# EAGLE design Recorder (EAGLE 9.6.2)

## Sheet 1 of 3: MCU
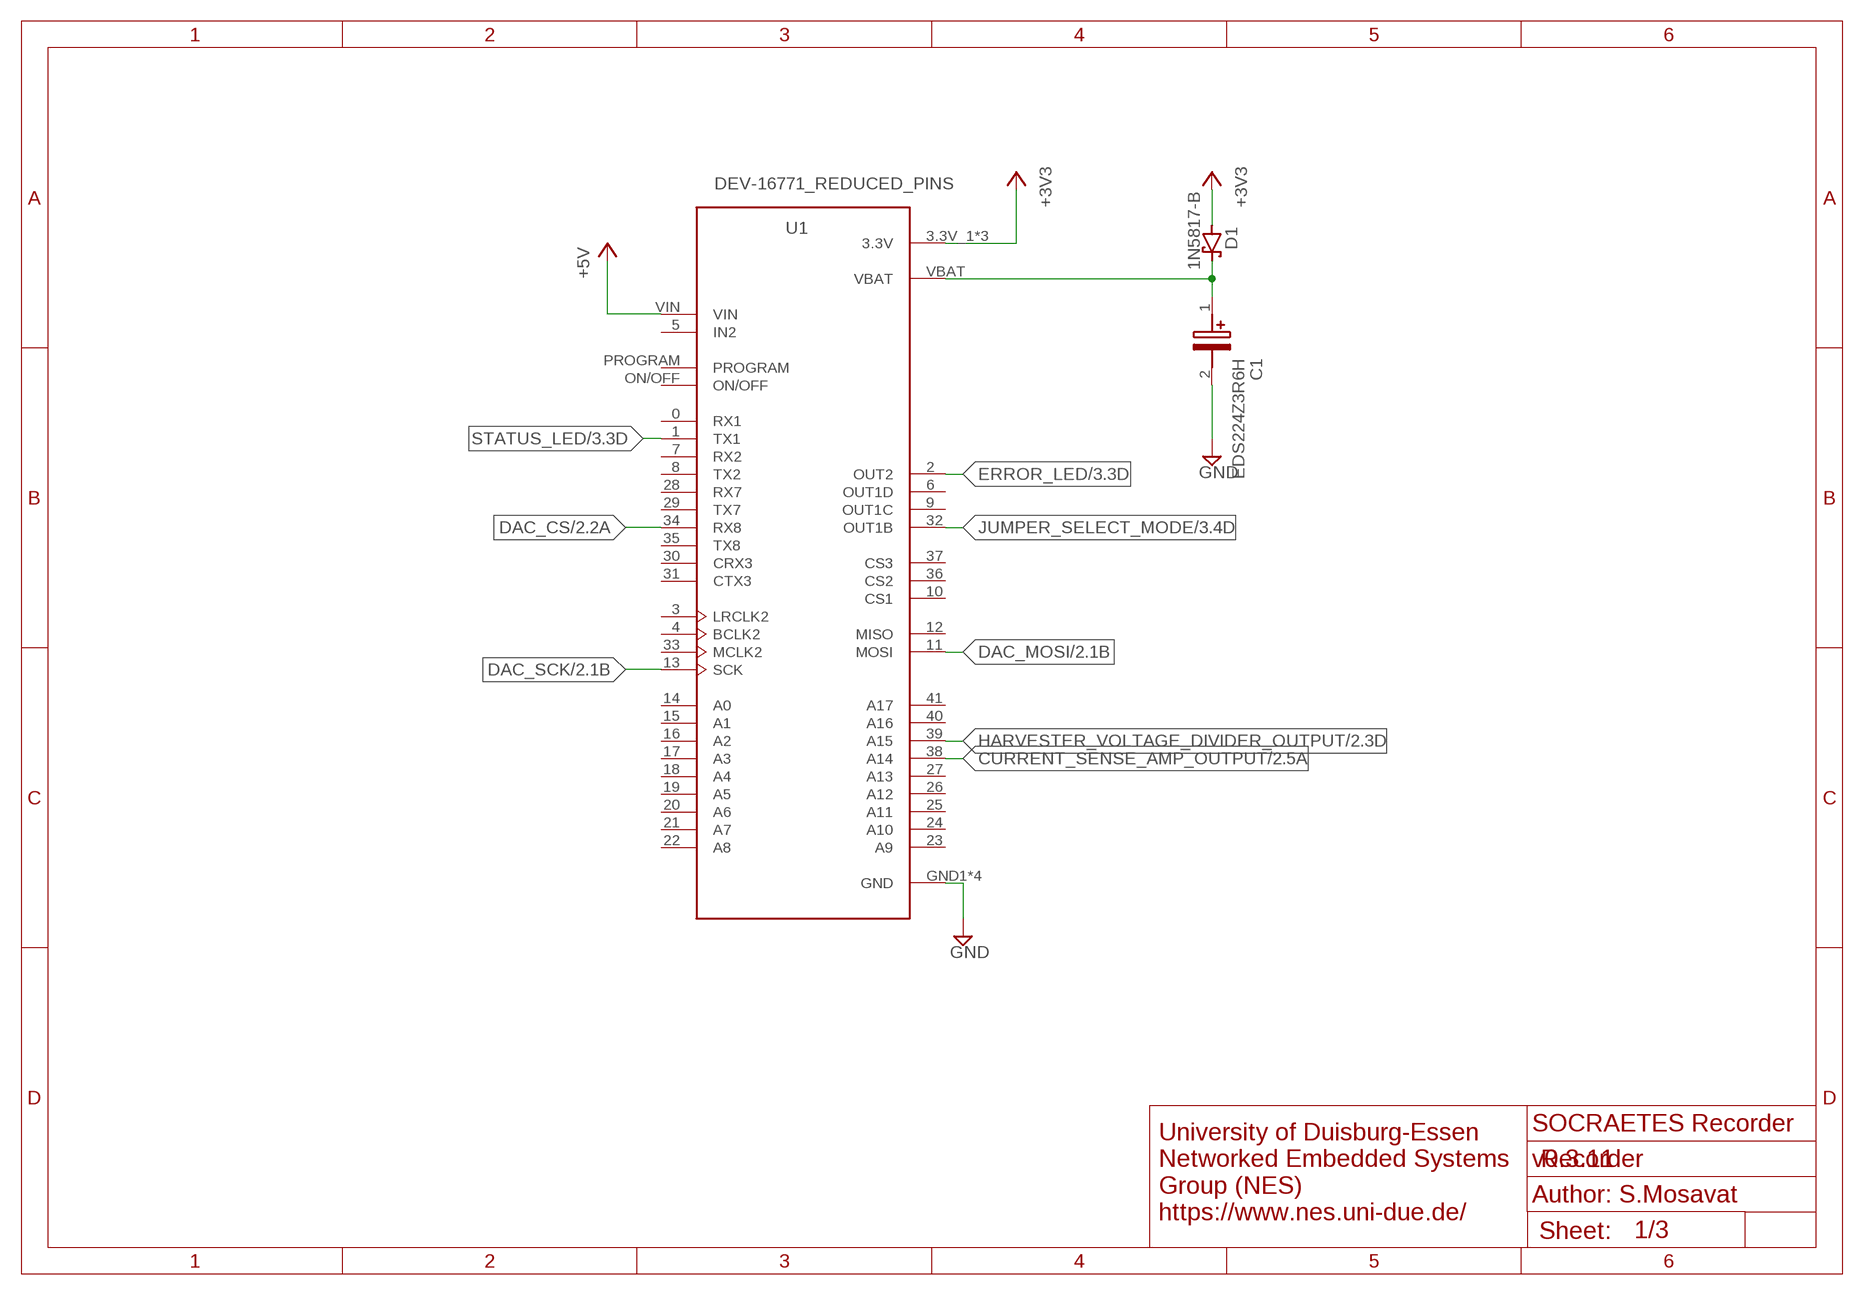
[diagram p0: schematic, sheet 1]

### Parts
C1  EDS224Z3R6H  [EDS224Z3R6H]
D1  1N5817-B  [DO41-7.6]
U1  DEV-16771_REDUCED_PINS  [MODULE_DEV-16771_REDUCED_PINS]

### Nets
+3V3: D1.A U1.3.3V_1(3.3V) U1.3.3V_2(3.3V) U1.3.3V_3(3.3V) ; also sheet 3
+5V: U1.VIN ; also sheet 2,3
CURRENT_SENSE_AMP_OUTPUT: U1.38(A14) ; also sheet 2
DAC_CS: U1.34(RX8) ; also sheet 2
DAC_MOSI: U1.11(MOSI) ; also sheet 2
DAC_SCK: U1.13(SCK) ; also sheet 2
ERROR_LED: U1.2(OUT2) ; also sheet 3
GND: C1.2(-) U1.GND1(GND) U1.GND2(GND) U1.GND3(GND) U1.GND4(GND) ; also sheet 2,3
HARVESTER_VOLTAGE_DIVIDER_OUTPUT: U1.39(A15) ; also sheet 2
JUMPER_SELECT_MODE: U1.32(OUT1B) ; also sheet 3
N$2: C1.1(+) D1.C U1.VBAT
STATUS_LED: U1.1(TX1) ; also sheet 3
Unconnected: U1.0(RX1) U1.3(LRCLK2) U1.4(BCLK2) U1.5(IN2) U1.6(OUT1D) U1.7(RX2) U1.8(TX2) U1.9(OUT1C) U1.10(CS1) U1.12(MISO) U1.14(A0) U1.15(A1) U1.16(A2) U1.17(A3) U1.18(A4) U1.19(A5) U1.20(A6) U1.21(A7) U1.22(A8) U1.23(A9) U1.24(A10) U1.25(A11) U1.26(A12) U1.27(A13) U1.28(RX7) U1.29(TX7) U1.30(CRX3) U1.31(CTX3) U1.33(MCLK2) U1.35(TX8) U1.36(CS2) U1.37(CS3) U1.40(A16) U1.41(A17) U1.ON/OFF U1.PROGRAM

### Notes on the sheet
- SOCRAETES Recorder
- v0.3.11
- Author: S.Mosavat
- University of Duisburg-Essen
  Networked Embedded Systems
  Group (NES)
  https://www.nes.uni-due.de/

## Sheet 2 of 3: Analog front-end
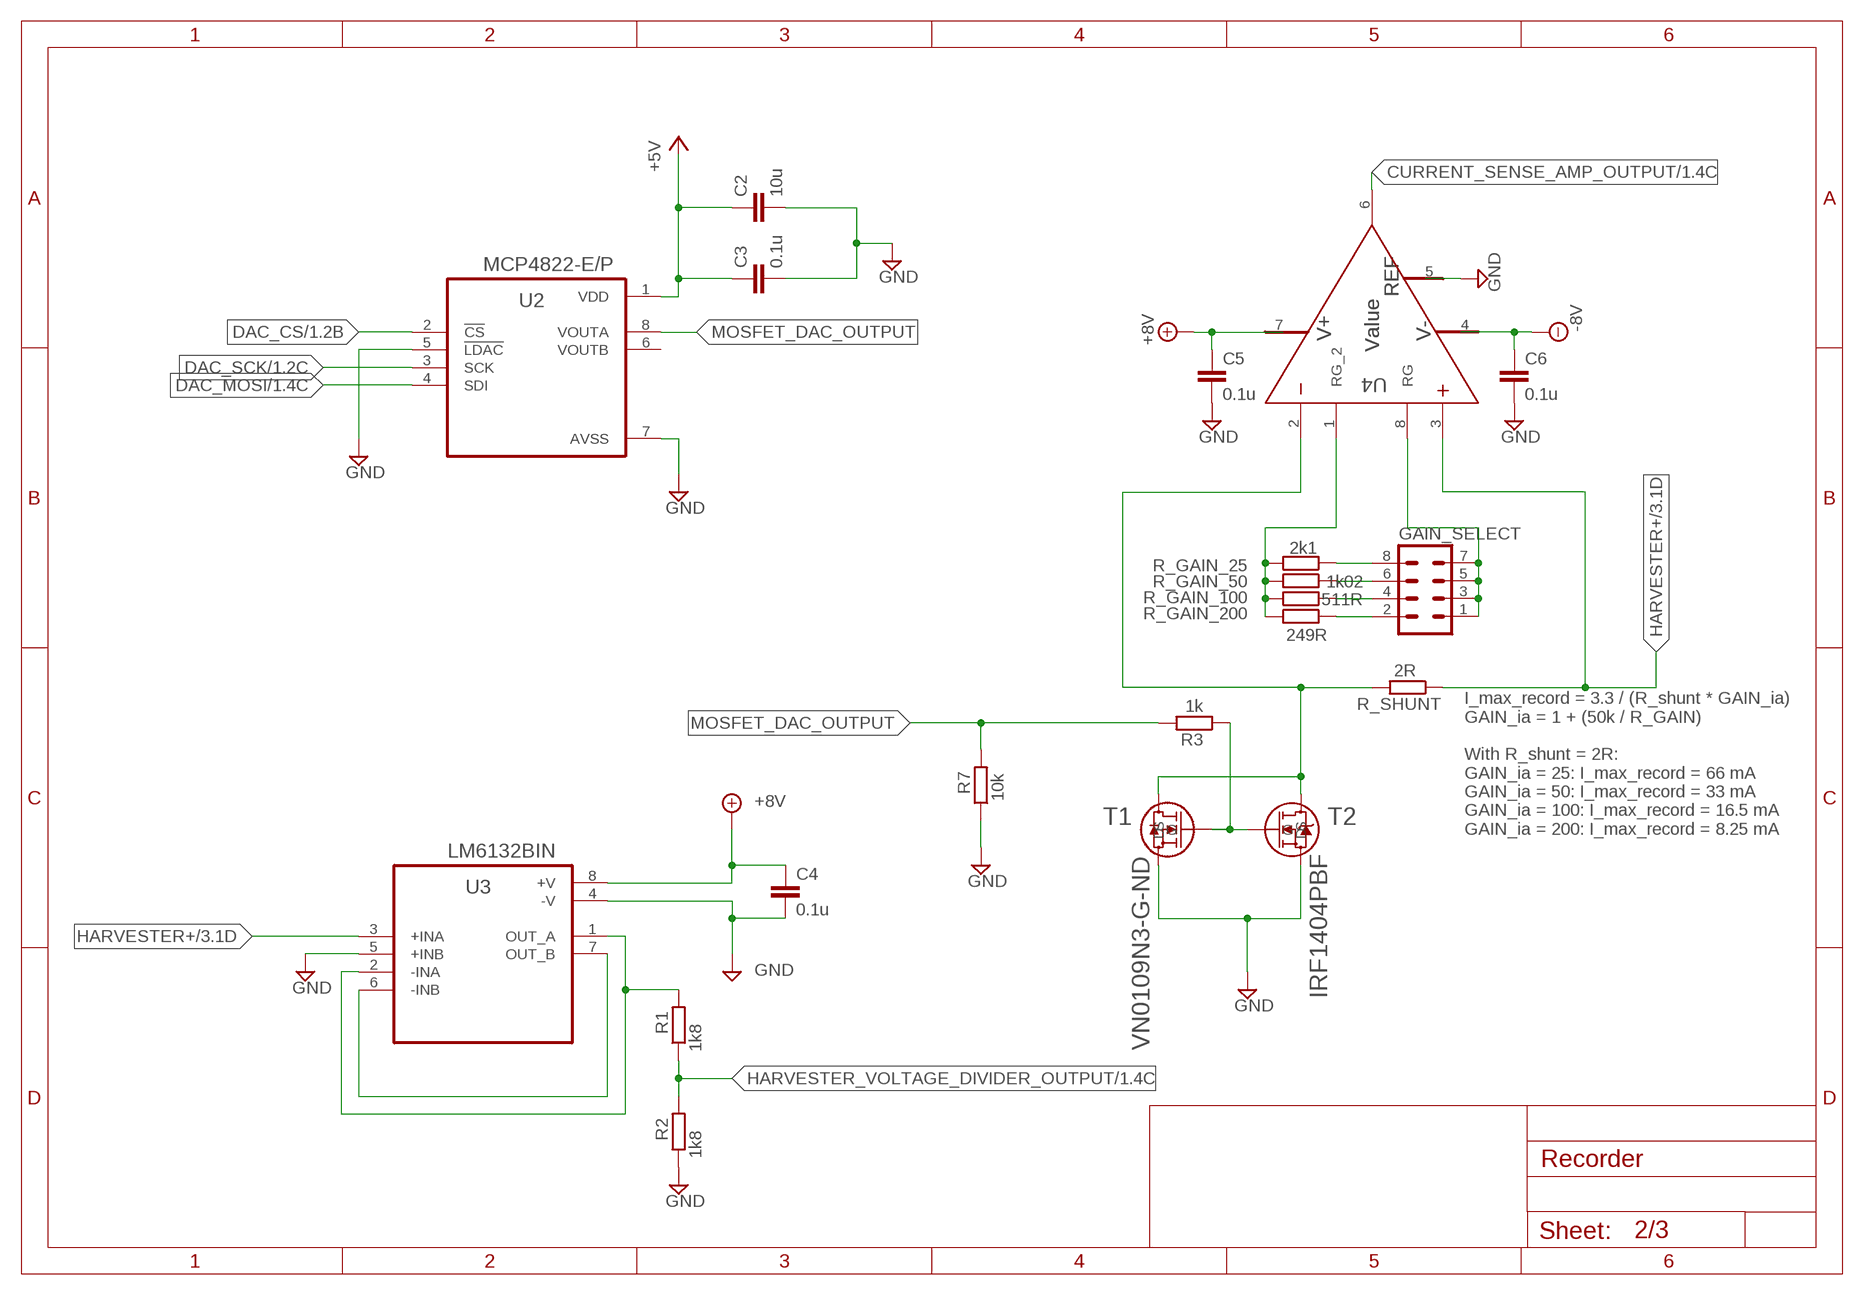
[diagram p1: schematic, sheet 2]

### Parts
C2  10u  C-EU025-024X044  [C025-024X044]
C3  0.1u  C-EU025-024X044  [C025-024X044]
C4  0.1u  C-EU025-024X044  [C025-024X044]
C5  0.1u  C-EU025-024X044  [C025-024X044]
C6  0.1u  C-EU025-024X044  [C025-024X044]
GAIN_SELECT  MA04-2  [MA04-2]
R1  1k8  R-EU_0207/10  [0207/10]
R2  1k8  R-EU_0207/10  [0207/10]
R3  1k  R-EU_0207/10  [0207/10]
R7  10k  R-EU_0207/10  [0207/10]
R_GAIN_25  2k1  R-EU_0207/10  [0207/10]
R_GAIN_50  1k02  R-EU_0207/10  [0207/10]
R_GAIN_100  511R  R-EU_0207/10  [0207/10]
R_GAIN_200  249R  R-EU_0207/10  [0207/10]
R_SHUNT  2R  R-EU_0207/10  [0207/10]
T1  VN0109N3-G-ND  [TO92-CBE]
T2  IRF1404PBF  [PG-TO220-3-904_INF]
U2  MCP4822-E/P  [DIP787W46P254L927H533Q8]
U3  LM6132BIN  [DIP794W45P254L959H508Q8]
U4  Value  INA121PA  [P0008A]

### Nets
+5V: C2.1 C3.1 U2.1(VDD) ; also sheet 1,3
+8V: C4.1 C5.1 U3.8(+V) U4.7(V+) ; also sheet 3
-8V: C6.1 U4.4(V-) ; also sheet 3
CURRENT_SENSE_AMP_OUTPUT: U4.6(OUT) ; also sheet 1
DAC_CS: U2.2(!CS) ; also sheet 1
DAC_MOSI: U2.4(SDI) ; also sheet 1
DAC_SCK: U2.3(SCK) ; also sheet 1
GND: C2.2 C3.2 C4.2 C5.2 C6.2 R2.1 R7.1 T1.SOURCE(S) T2.S U2.5(!LDAC) U2.7(AVSS) U3.4(-V) U3.5(+INB) U4.5(REF) ; also sheet 1,3
HARVESTER+: R_SHUNT.1 U3.3(+INA) U4.3(IN+) ; also sheet 3
HARVESTER_VOLTAGE_DIVIDER_OUTPUT: R1.1 R2.2 ; also sheet 1
MOSFET_DAC_OUTPUT: R3.2 R7.2 U2.8(VOUTA)
N$1: GAIN_SELECT.8 R_GAIN_25.1
N$3: GAIN_SELECT.6 R_GAIN_50.1
N$5: U3.6(-INB) U3.7(OUT_B)
N$6: R_SHUNT.2 T1.DRAIN(D) T2.D U4.2(IN-)
N$8: R1.2 U3.1(OUT_A) U3.2(-INA)
N$10: GAIN_SELECT.4 R_GAIN_100.1
N$11: R3.1 T1.GATE(G) T2.G
N$12: R_GAIN_25.2 R_GAIN_50.2 R_GAIN_100.2 R_GAIN_200.2 U4.1(RG_2)
N$13: GAIN_SELECT.1 GAIN_SELECT.3 GAIN_SELECT.5 GAIN_SELECT.7 U4.8(RG)
N$14: GAIN_SELECT.2 R_GAIN_200.1
Unconnected: U2.6(VOUTB)

### Notes on the sheet
- I_max_record = 3.3 / (R_shunt * GAIN_ia)
  GAIN_ia = 1 + (50k / R_GAIN)
  
  With R_shunt = 2R:
  GAIN_ia = 25: I_max_record = 66 mA
  GAIN_ia = 50: I_max_record = 33 mA
  GAIN_ia = 100: I_max_record = 16.5 mA
  GAIN_ia = 200: I_max_record = 8.25 mA

## Sheet 3 of 3: Power
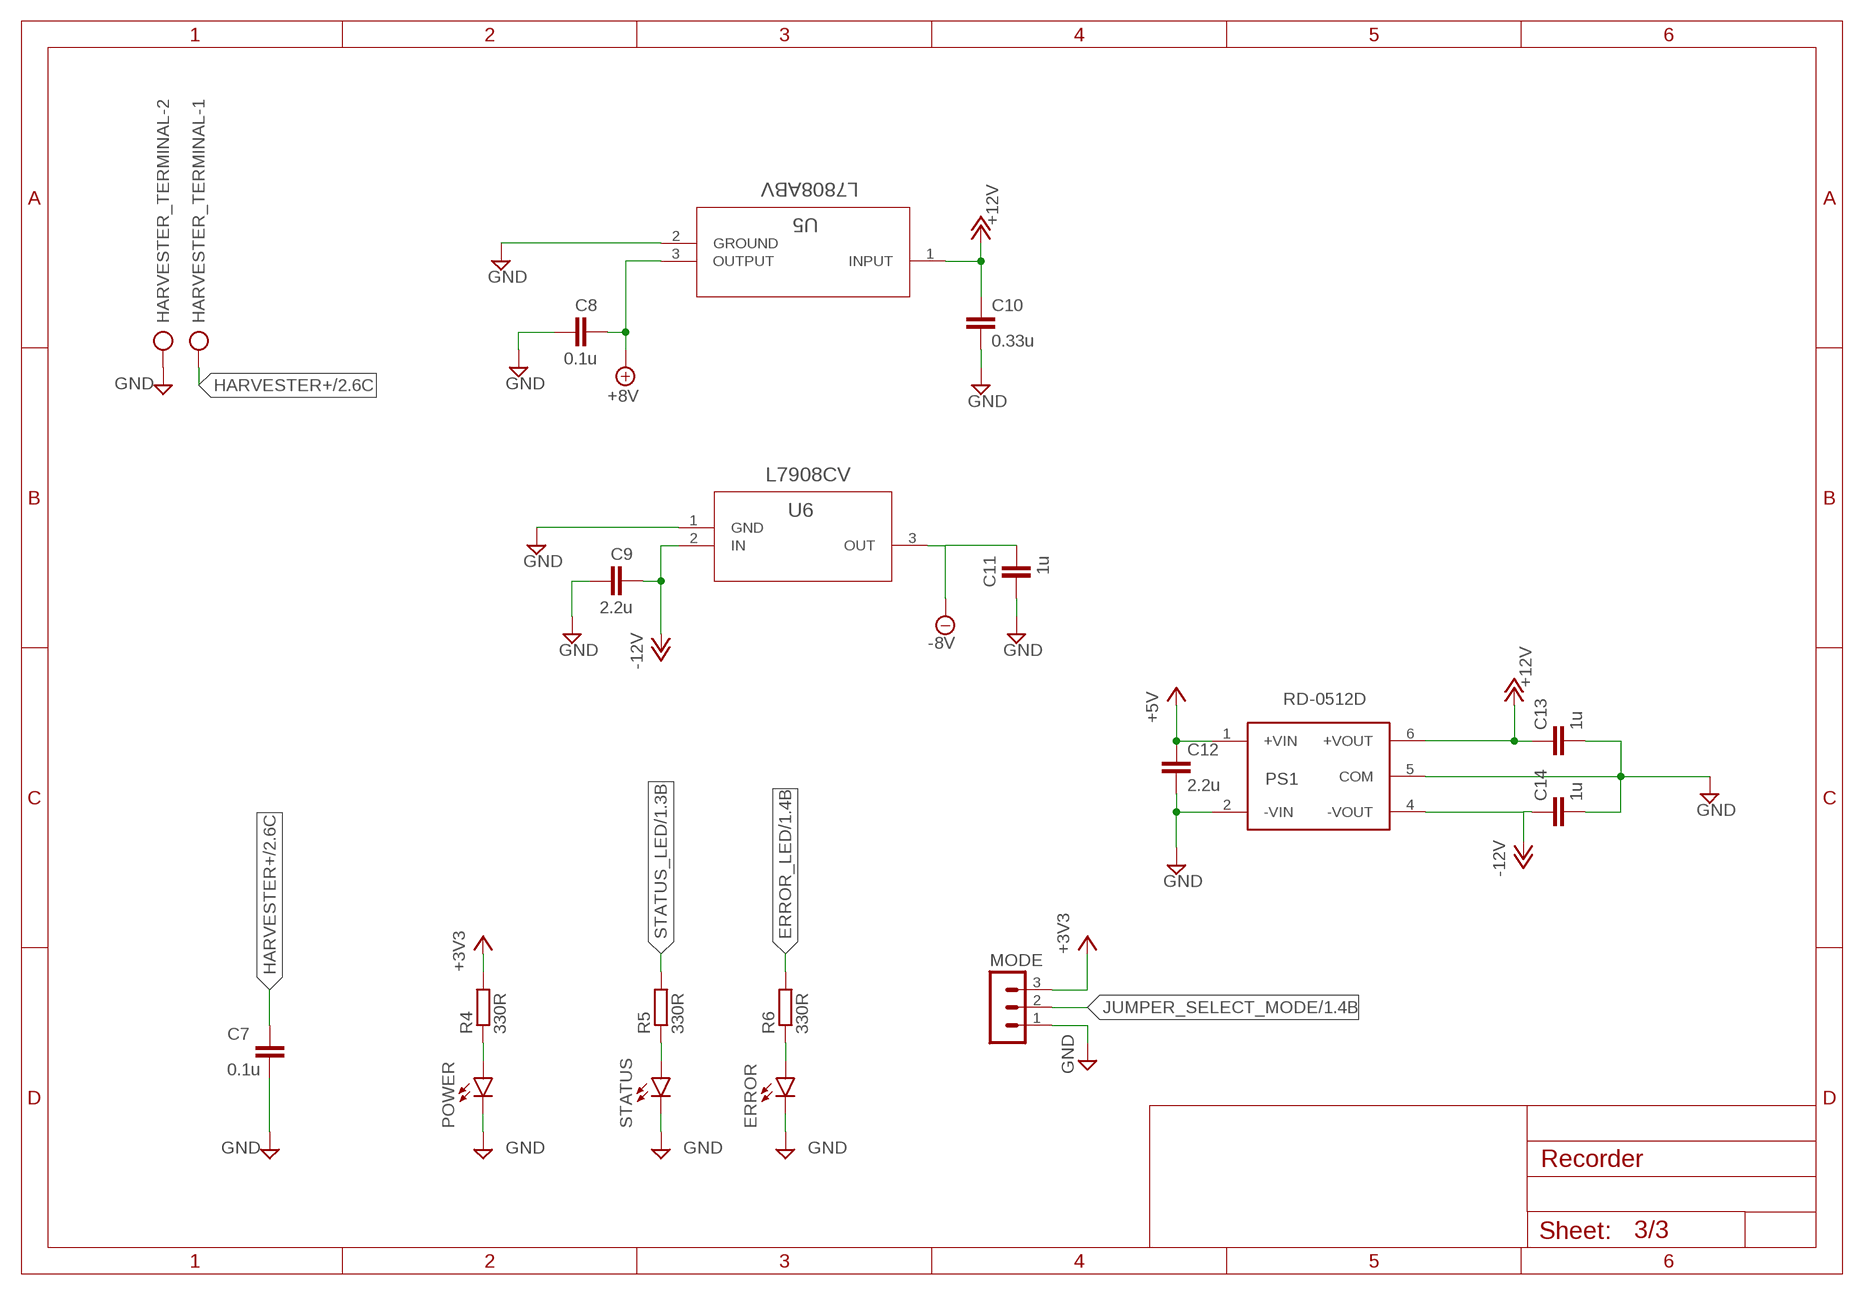
[diagram p2: schematic, sheet 3]

### Parts
C7  0.1u  C-EU025-024X044  [C025-024X044]
C8  0.1u  C-EU025-024X044  [C025-024X044]
C9  2.2u  C-EU025-024X044  [C025-024X044]
C10  0.33u  C-EU025-024X044  [C025-024X044]
C11  1u  C-EU025-024X044  [C025-024X044]
C12  2.2u  C-EU025-024X044  [C025-024X044]
C13  1u  C-EU025-024X044  [C025-024X044]
C14  1u  C-EU025-024X044  [C025-024X044]
ERROR  LED5MM  [LED5MM]
HARVESTER_TERMINAL  AK300/2  [AK300/2]
MODE  MA03-1  [MA03-1]
POWER  LED5MM  [LED5MM]
PS1  RD-0512D  [CONV_RD-0512D]
R4  330R  R-EU_0207/10  [0207/10]
R5  330R  R-EU_0207/10  [0207/10]
R6  330R  R-EU_0207/10  [0207/10]
STATUS  LED5MM  [LED5MM]
U5  L7808ABV  [TO-220_STM]
U6  L7908CV  [TO-220_STM]

### Nets
+3V3: MODE.3 R4.2 ; also sheet 1
+5V: C12.1 PS1.1(+VIN) ; also sheet 1,2
+8V: C8.2 U5.3(OUTPUT) ; also sheet 2
+12V: C10.1 C13.1 PS1.6(+VOUT) U5.1(INPUT)
-8V: C11.2 U6.3(OUT) ; also sheet 2
-12V: C9.2 C14.1 PS1.4(-VOUT) U6.2(IN)
ERROR_LED: R6.2 ; also sheet 1
GND: C7.2 C8.1 C9.1 C10.2 C11.1 C12.2 C13.2 C14.2 ERROR.K(C) HARVESTER_TERMINAL.2 MODE.1 POWER.K(C) PS1.2(-VIN) PS1.5(COM) STATUS.K(C) U5.2(GROUND) U6.1(GND) ; also sheet 1,2
HARVESTER+: C7.1 HARVESTER_TERMINAL.1 ; also sheet 2
JUMPER_SELECT_MODE: MODE.2 ; also sheet 1
N$4: ERROR.A R6.1
N$7: R5.1 STATUS.A
N$9: POWER.A R4.1
STATUS_LED: R5.2 ; also sheet 1

## Library data of the parts
C1 = SamacSys_Parts:EDS224Z3R6H: Supercapacitors / Ultracapacitors 0.22F 3.6V 85C Source: Datasheet <https://ms.componentsearchengine.com/Datasheets/1/EDS224Z3R6H.pdf>; DESCRIPTION: Supercapacitors / Ultracapacitors 0.22F 3.6V 85C; HEIGHT: 6mm; MANUFACTURER_NAME: Cornell Dubilier; MANUFACTURER_PART_NUMBER: EDS224Z3R6H; MOUSER_PART_NUMBER: 598-EDS224Z3R6H; MOUSER_PRICE-STOCK: https://www.mouser.co.uk/ProductDetail/Cornell-Dubilier-CDE/EDS224Z3R6H?qs=bZr6mbWTK5lViRat0kLgfg%3D%3D
C2-C14 = rcl:C-EU: CAPACITOR, European symbol; SPICEPREFIX: C
D1 = diode:1N581*: 1.0A SCHOTTKY BARRIER RECTIFIER Source: http://www.diodes.com/datasheets/ds23001.pdf
ERROR POWER STATUS = led:LED: LED OSRAM: - CHIPLED LG R971, LG N971, LY N971, LG Q971, LY Q971, LO R971, LY R971 LH N974, LH R974 LS Q976, LO Q976, LY Q976 LO Q996 - Hyper CHIPLED LW Q18S LB Q993, LB Q99A, LB R99A - SideLED LS A670, LO A670, LY A670, LG A670, LP A670 LB A673, LV A673, LT A673, LW A673 LH A674 LY A675 LS A676, LA A676, LO A676, LY A676, LW A676 LS A679, LY A679, LG A679 - Hyper Micro SIDELED® LS Y876, LA Y876, LO Y876, LY Y876 LT Y87S - SmartLED LW L88C, LW L88S LB L89C, LB L89S, LG L890 LS L89K, LO L89K, LY L89K LS L896, LA L896, LO L896, LY L896 - TOPLED LS T670, LO T670, LY T670, LG T670, LP T670 LSG T670, LSP T670, LSY T670, LOP T670, LYG T670 LG T671, LOG T671, LSG T671 LB T673, LV T673, LT T673, LW T673 LH T674 LS T676, LA T676, LO T676, LY T676, LB T676, LH T676, LSB T676, LW T676 LB T67C, LV T67C, LT T67C, LS T67K, LO T67K, LY T67K, LW E67C LS E67B, LA E67B, LO E67B, LY E67B, LB E67C, LV E67C, LT E67C LW T67C LS T679, LY T679, LG T679 LS T770, LO T770, LY T770, LG T770, LP T770 LB T773, LV T773, LT T773, LW T773 LH T774 LS E675, LA E675, LY E675, LS T675 LS T776, LA T776, LO T776, LY T776, LB T776 LHGB T686 LT T68C, LB T68C - Hyper Mini TOPLED® LB M676 - Mini TOPLED Santana® LG M470 LS M47K, LO M47K, LY M47K Source: http://www.osram.convergy.de LUXEON: - LUMILED® LXK2-PW12-R00, LXK2-PW12-S00, LXK2-PW14-U00, LXK2-PW14-V00 LXK2-PM12-R00, LXK2-PM12-S00, LXK2-PM14-U00 LXK2-PE12-Q00, LXK2-PE12-R00, LXK2-PE12-S00, LXK2-PE14-T00, LXK2-PE14-U00 LXK2-PB12-K00, LXK2-PB12-L00, LXK2-PB12-M00, LXK2-PB14-N00, LXK2-PB14-P00, LXK2-PB14-Q00 LXK2-PR12-L00, LXK2-PR12-M00, LXK2-PR14-Q00, LXK2-PR14-R00 LXK2-PD12-Q00, LXK2-PD12-R00, LXK2-PD12-S00 LXK2-PH12-R00, LXK2-PH12-S00 LXK2-PL12-P00, LXK2-PL12-Q00, LXK2-PL12-R00 Source: www.luxeon.com KINGBRIGHT: KA-3528ASYC Source: www.kingbright.com
GAIN_SELECT = con-lstb:MA04-2: PIN HEADER; OC_FARNELL: unknown; OC_NEWARK: unknown
HARVESTER_TERMINAL = con-ptr500:AK300/2: CONNECTOR; OC_FARNELL: unknown; OC_NEWARK: unknown
MODE = con-lstb:MA03-1: PIN HEADER; OC_FARNELL: unknown; OC_NEWARK: unknown
PS1 = RD-0512D:RD-0512D: 2 Watt SIP7 Dual Output Check availability <https://pricing.snapeda.com/parts/RD-0512D/Recom%20Power/view-part?ref=eda>; AVAILABILITY: In Stock; DESCRIPTION: 2W DC/DC-Converter 'ECONOLINE' SIP7 1kV unreg; MF: Recom Power; MP: RD-0512D; PACKAGE: SIP-7 Recom Power; PRICE: None; PURCHASE-URL: https://pricing.snapeda.com/search/part/RD-0512D/?ref=eda
R1-R7 R_GAIN_25 R_GAIN_50 R_GAIN_100 R_GAIN_200 R_SHUNT = rcl:R-EU_: RESISTOR, European symbol; SPICEPREFIX: R
T1 = NES_Solar_Cell_Recorder_And_Emulator:VN0109N3-G-ND: ZVN4424A N-Channel MOSFET
T2 = IRF1404PBF:IRF1404PBF; COPYRIGHT: Copyright (C) 2023 Ultra Librarian. All rights reserved.; DIGIKEY_PART_NUMBER_1: IRF1404PBF-ND; MANUFACTURER_PART_NUMBER: IRF1404PBF; MFR_NAME: Infineon
U1 = DEV-16771 (Teensy 41):DEV-16771_REDUCED_PINS: RT1062 Teensy 4.1 i.MX ARM Cortex-M7 MPU Embedded Evaluation Board Check availability <https://pricing.snapeda.com/parts/DEV-16771/SparkFun%20Electronics/view-part?ref=eda>
U2 = MCP4822-E_P:MCP4822-E/P: Check availability <https://pricing.snapeda.com/parts/MCP4822-E/P/Microchip/view-part?ref=eda>; AVAILABILITY: In Stock; DESCRIPTION: 12 Bit Digital to Analog Converter 2 8-PDIP; MF: Microchip; MP: MCP4822-E/P; PACKAGE: DIP-8 Microchip; PRICE: None; PURCHASE-URL: https://pricing.snapeda.com/search/part/MCP4822-E/P/?ref=eda
U3 = LM6132BIN:LM6132BIN; DESCRIPTION: Dual Low Power 10 MHz Rail-to-Rail I/O Operational Amplifier 8-PDIP -40 to 85; DIGI-KEY_PART_NUMBER: LM6132BIN/NOPB-ND; MF: Texas Instruments; MP: LM6132BIN/NOPB; PACKAGE: PDIP-8 Texas; PURCHASE-URL: https://pricing.snapeda.com/search/part/LM6132BIN/NOPB/?ref=eda
U4 = INA121PA:INA121PA; MANUFACTURER: Texas Instruments; PARTNUMBER: INA121P; REFDES: RefDes; TYPE: TYPE
U5 = L7808ABV:L7808ABV; BUILT_BY: EMA_UL_Team; MANUFACTURER_PART_NUMBER: L7808ABV; SOURCELIBRARY: Updates_to_database_2020-11-10; VENDOR: STMicroelectronics
U6 = L7908CV:L7908CV; BUILT_BY: EMA_UL_Team; MANUFACTURER_PART_NUMBER: L7908CV; SOURCELIBRARY: Updates_to_database_2020-11-13; VENDOR: STMicroelectronics

## Board
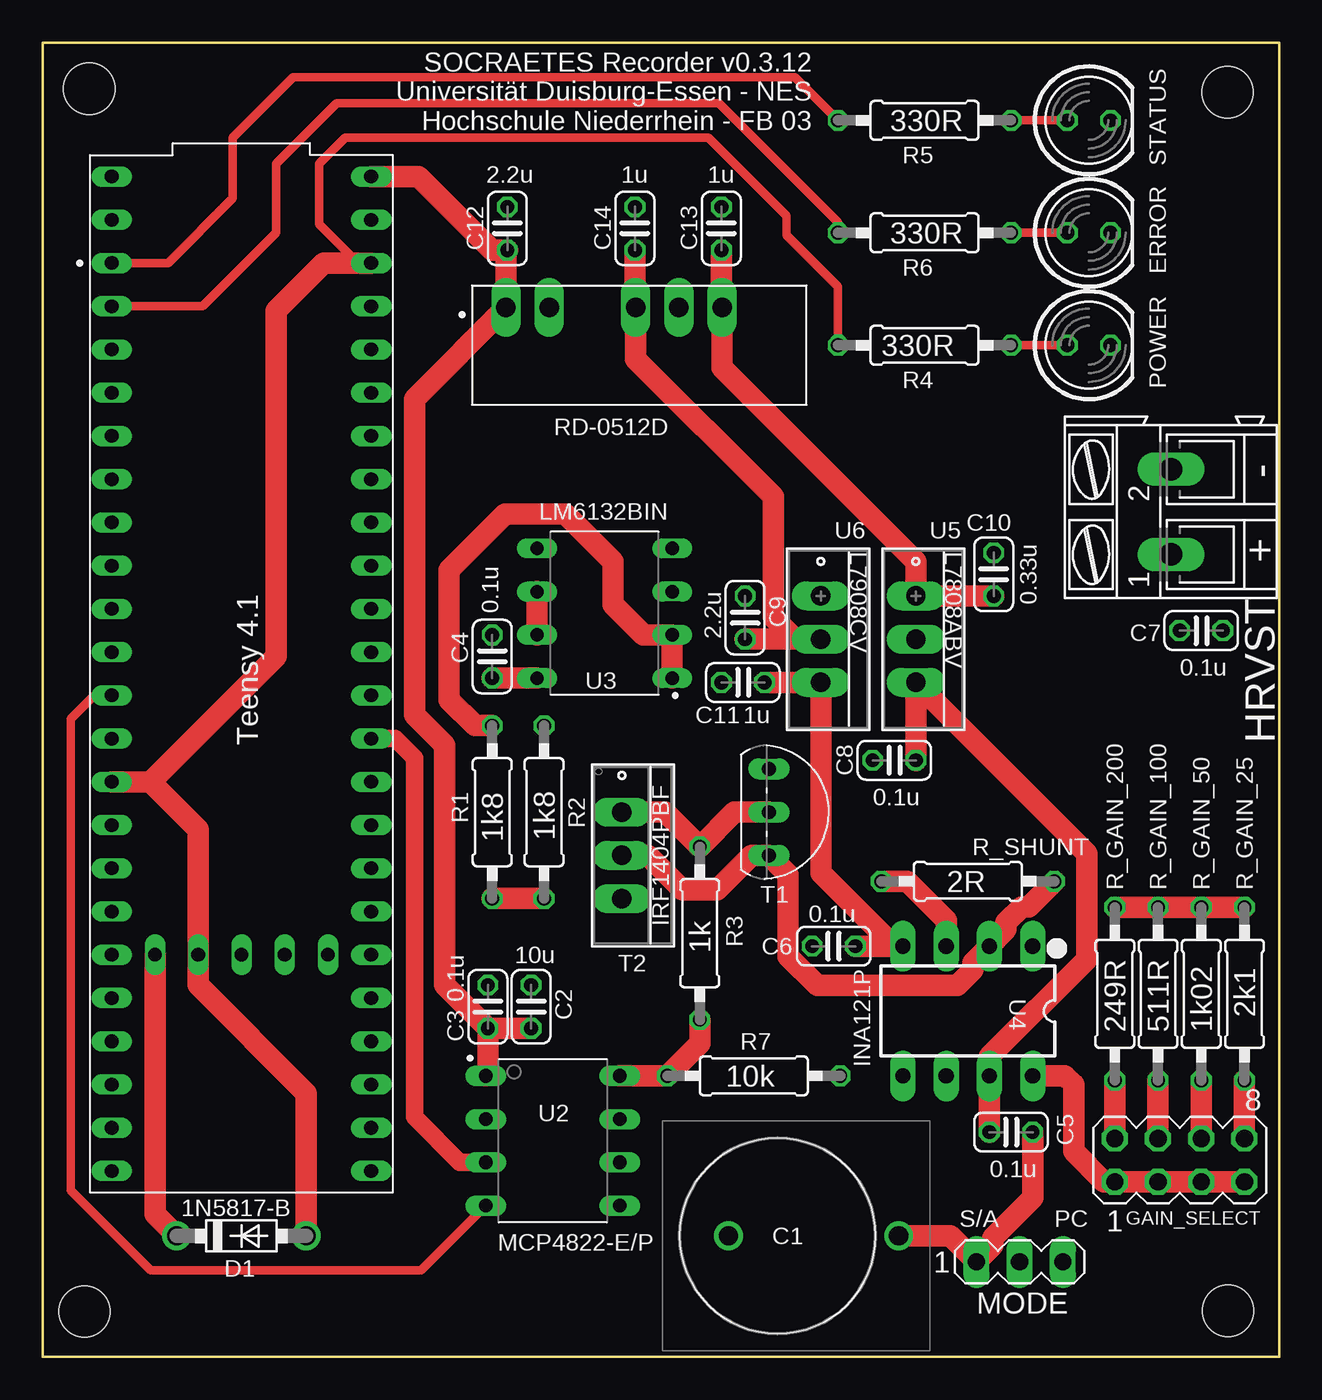
[diagram p3: board, top side]
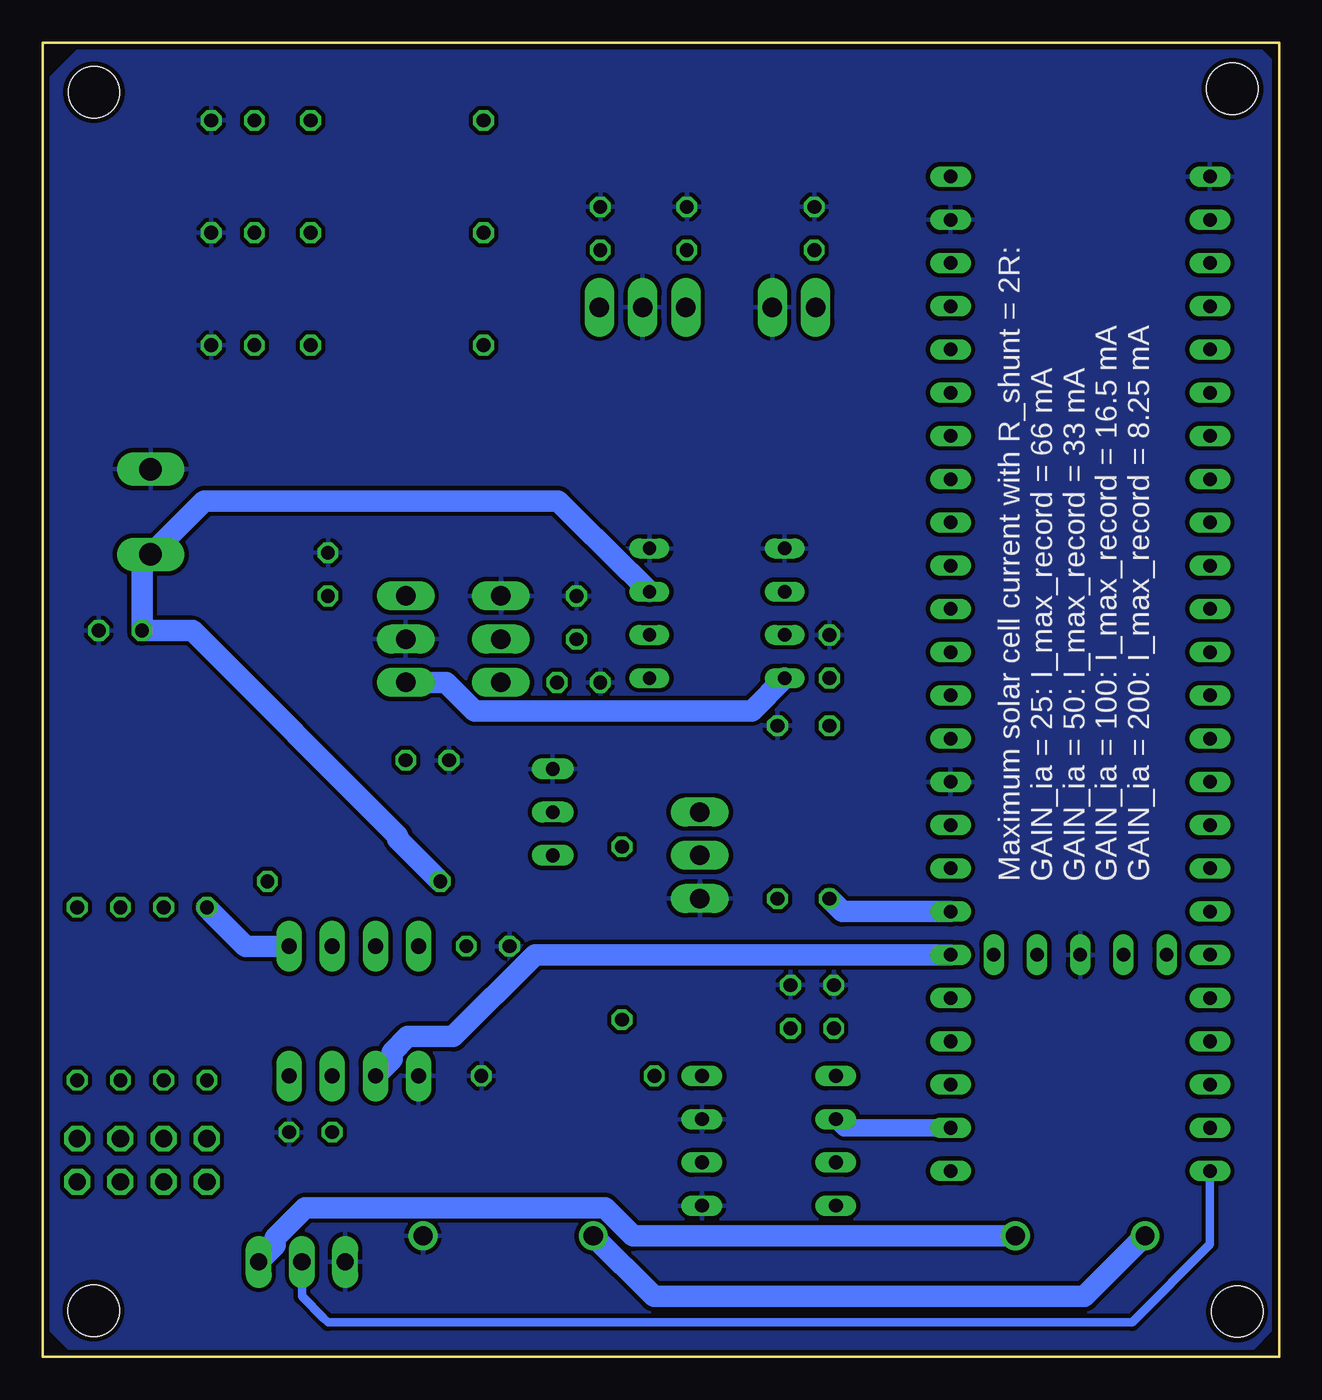
[diagram p4: board, bottom side, seen from below]

Size 72.64 x 77.22 mm. Coordinates in mm from the lower left corner, seen from the top.
Outline: 0,77.22 72.64,77.22 72.64,0 0,0 0,77.22
Copper layers (1*16): Top 0.035mm / dielectric 1.5mm / Bottom 0.035mm
Design rules "aisler_2_layer_simple *": minimum track width 0.2mm, minimum drill 0.45mm, track to track 0.25mm, track to pad 0.175mm, pad to pad 0.175mm, via to via 0.175mm, smd to smd 0.175mm, copper to edge 0.3mm, drill to drill 0.25mm, minimum pad ring 0.2mm, minimum via ring 0.2mm, stop-mask expansion 0mil, vias tented up to drill 50mil, thermal gap 10mil
Holes 3 mm at 2.74,74.5 69.62,74.3 69.65,2.72 2.46,2.67

### Footprints (pad centres in the part's own frame; a part is rotated, then mirrored left to right if it is on the bottom)
EDS224Z3R6H = drill 1.13 pad 1.695: 1 -0.16,0; 2 -10.16,0
C025-024X044 = drill 0.813 octagon: 1 -1.27,0; 2 1.27,0
DO41-7.6 = drill 1.1 pad 1.7: A 3.81,0; C -3.81,0
LED5MM = drill 0.813 octagon: A -1.27,0; K 1.27,0
MA04-2 = drill 1.016 octagon: 1 -3.81,-1.27; 2 -3.81,1.27; 3 -1.27,-1.27; 4 -1.27,1.27; 5 1.27,-1.27; 6 1.27,1.27; 7 3.81,-1.27; 8 3.81,1.27
AK300/2 = drill 1.321 long: 1 -2.515,0; 2 2.489,0
MA03-1 = drill 1.016 long: 1 -2.54,0; 2 0,0; 3 2.54,0
CONV_RD-0512D = drill 1.15 pad 1.676 long: 1 -7.825,2.23; 2 -5.285,2.23; 4 -0.205,2.23; 5 2.335,2.23; 6 4.875,2.23
0207/10 = drill 0.813 octagon: 1 -5.08,0; 2 5.08,0
TO92-CBE = drill 0.813 long: DRAIN 2.54,0; GATE 0,0; SOURCE -2.54,0
PG-TO220-3-904_INF = drill 1.143 pad 1.651 long: D 2.54,0; G 0,0; S 5.08,0
MODULE_DEV-16771_REDUCED_PINS = drill 0.8 pad 1.143 long: 0 -26.67,-7.62; 1 -24.13,-7.62; 2 -21.59,-7.62; 3 -19.05,-7.62; 3.3V_1 6.35,-7.62; 3.3V_2 -24.13,7.62; 3.3V_3 16.51,-2.54; 4 -16.51,-7.62; 5 -13.97,-7.62; 6 -11.43,-7.62; 7 -8.89,-7.62; 8 -6.35,-7.62; 9 -3.81,-7.62; 10 -1.27,-7.62; 11 1.27,-7.62; 12 3.81,-7.62; 13 3.81,7.62; 14 1.27,7.62; 15 -1.27,7.62; 16 -3.81,7.62; 17 -6.35,7.62; 18 -8.89,7.62; 19 -11.43,7.62; 20 -13.97,7.62; 21 -16.51,7.62; 22 -19.05,7.62; 23 -21.59,7.62; 24 8.89,-7.62; 25 11.43,-7.62; 26 13.97,-7.62; 27 16.51,-7.62; 28 19.05,-7.62; 29 21.59,-7.62; 30 24.13,-7.62; 31 26.67,-7.62; 32 29.21,-7.62; 33 29.21,7.62; 34 26.67,7.62; 35 24.13,7.62; 36 21.59,7.62; 37 19.05,7.62; 38 16.51,7.62; 39 13.97,7.62; 40 11.43,7.62; 41 8.89,7.62; GND1 -29.21,-7.62; GND2 6.35,7.62; GND3 -26.67,7.62; GND4 16.51,0; ON/OFF 16.51,5.08; PROGRAM 16.51,2.54; VBAT 16.51,-5.08; VIN -29.21,7.62
DIP787W46P254L927H533Q8 = drill 0.8 pad 1.143 long: 1 -3.935,3.81; 2 -3.935,1.27; 3 -3.935,-1.27; 4 -3.935,-3.81; 5 3.935,-3.81; 6 3.935,-1.27; 7 3.935,1.27; 8 3.935,3.81
DIP794W45P254L959H508Q8 = drill 0.78 pad 1.143 long: 1 -3.97,3.81; 2 -3.97,1.27; 3 -3.97,-1.27; 4 -3.97,-3.81; 5 3.97,-3.81; 6 3.97,-1.27 | drill 0.78 pad 1.13 long: 7 3.97,1.27; 8 3.97,3.81
P0008A = drill 0.889 pad 1.499 long: 1 -3.81,3.81; 2 -3.81,1.27; 3 -3.81,-1.27; 4 -3.81,-3.81; 5 3.81,-3.81; 6 3.81,-1.27; 7 3.81,1.27; 8 3.81,3.81
TO-220_STM = drill 1.143 pad 1.651 long: 1 0,0; 2 2.54,0; 3 5.08,0

### Placement (x,y rotation side)
C1  40.13,7.11 180 top
C2  28.7,20.57 90 top
C3  26.16,20.57 90 top
C4  26.42,41.15 90 top
C5  56.9,13.21 0 top
C6  46.48,24.13 180 top
C7  68.07,42.67 0 top
C8  50.04,35.05 0 top
C9  41.27,43.43 270 top
C10  55.88,45.97 90 top
C11  41.15,39.62 0 top
C12  27.3,66.29 90 top
C13  39.88,66.29 90 top
C14  34.8,66.29 90 top
D1  11.68,7.11 0 top
ERROR  61.47,66.04 0 top
GAIN_SELECT  66.8,11.56 0 top
HARVESTER_TERMINAL  66.29,49.66 90 top
MODE  57.4,5.59 0 top
POWER  61.47,59.44 0 top
PS1  35.05,59.44 0 top
R1  26.42,32 90 top
R2  29.46,32 270 top
R3  38.61,24.89 270 top
R4  51.82,59.44 180 top
R5  51.82,72.64 180 top
R6  51.82,66.04 180 top
R7  41.78,16.51 180 top
R_GAIN_25  70.61,21.34 90 top
R_GAIN_50  68.07,21.34 90 top
R_GAIN_100  65.53,21.34 90 top
R_GAIN_200  62.99,21.34 90 top
R_SHUNT  54.36,27.94 0 top
STATUS  61.47,72.64 0 top
T1  42.67,32 270 top
T2  34.04,32 270 top
U1  11.68,40.13 270 top
U2  29.97,12.7 0 top
U3  33.02,43.69 180 top
U4  54.36,20.32 270 top
U5  51.31,44.7 270 top
U6  45.72,44.7 270 top

### Tracks (layer width: path | path; a pad name or v marks a point on that pad's centre or on a via)
+3V3
  Top 0.508: U1.3.3V_2 18.54,64.26 16.26,66.55 16.26,70.1 17.78,71.63 39.12,71.63 43.69,67.06 43.69,65.91 46.74,62.87 R4.2
  Top 1.27: D1.A 15.49,15.49 9.14,21.84 U1.3.3V_3 9.14,30.99 6.35,33.78 | U1.3.3V_1 6.35,33.78 | 6.35,33.78 13.72,41.15 13.72,61.47 16.51,64.26 U1.3.3V_2
  Bottom 1.27: MODE.3 58.98,6.56 58.98,7 57.21,8.77 39.6,8.77 37.95,7.11 D1.A
+5V
  Top 1.27: U1.VIN 22.1,69.34 26.42,65.02 C12.1 27.23,64.95 PS1.1 21.84,56.28 21.84,37.72 23.62,35.94 23.62,21.84 C3.1 | C3.1 26.16,16.64 U2.1 | C3.1 C2.1
+8V
  Top 1.27: C4.1 U3.8 | C8.2 U5.3 61.34,29.59 61.34,23.37 55.63,17.65 U4.7 C5.1
  Bottom 1.27: U5.3 48.94,39.62 47.27,37.96 30.97,37.96 U3.8
+12V
  Top 1.27: C13.1 39.88,61.72 PS1.6 39.93,58.12 51.31,46.74 U5.1 C10.1
-8V
  Top 0.508: U4.4 50.04,24.13
  Top 1.27: 50.04,24.13 45.72,28.45 U6.3 C11.2 | C6.1 U4.4
-12V
  Top 1.27: C14.1 34.8,61.72 PS1.4 34.85,58.62 42.93,50.55 42.93,43.43 44.2,42.16 U6.2 C9.2
CURRENT_SENSE_AMP_OUTPUT
  Bottom 1.27: U4.6 52.1,17.49 52.1,17.91 51.19,18.82 48.52,18.82 43.71,23.62 U1.38
DAC_CS
  Bottom 1.016: U1.34 25.53,13.46 U2.2
DAC_MOSI
  Top 0.508: U1.11 3.05,38.86 1.65,37.47 1.65,9.78 6.35,5.08 22.23,5.08 U2.4
DAC_SCK
  Top 1.016: U2.3 24.51,11.43 21.84,14.1 21.84,35.18 20.7,36.32 U1.13
ERROR_LED
  Top 0.508: U1.2 9.4,61.72 13.72,66.04 13.72,70.1 17.27,73.66 39.75,73.66 46.74,66.67 R6.2
GND
  Top 1.27: C1.2 53.34,7.11 MODE.1 55.83,6.56 55.83,7 58.17,9.34 C5.2
  pour Bottom: 1.02,76.71 70.61,76.71 72.14,75.18 72.14,1.52 71.12,0.51 1.52,0.51 0.51,1.52 0.51,76.2
HARVESTER+
  Top 1.27: R_SHUNT.1 50.8,27.94 53.09,25.65 U4.3
  Bottom 1.27: R_SHUNT.1 51.78,30.44 51.78,30.62 63.83,42.67 C7.1 66.8,46.63 HARVESTER_TERMINAL.1 63.14,50.29 42.35,50.29 38.16,46.1 38.13,46.1 U3.3
HARVESTER_VOLTAGE_DIVIDER_OUTPUT
  Top 1.27: R1.1 R2.2
  Bottom 1.27: U1.39 25.65,26.16 R1.1
JUMPER_SELECT_MODE
  Bottom 0.508: U1.32 4.06,6.6 8.64,2.03 55.88,2.03 56.13,2.29 57.4,3.56 MODE.2
MOSFET_DAC_OUTPUT
  Top 1.27: U2.8 R7.2 38.61,18.41 R3.2
N$1
  Top 1.27: R_GAIN_25.1 GAIN_SELECT.8
N$2
  Top 1.27: D1.C 6.6,8.38 U1.VBAT
  Bottom 1.27: D1.C 11.43,3.56 36.74,3.56 C1.1
N$3
  Top 1.27: R_GAIN_50.1 GAIN_SELECT.6
N$4
  Top 0.508: R6.1 ERROR.A
N$5
  Top 1.27: U3.6 U3.7
N$6
  Top 1.27: T2.D 35.56,29.46 37.59,27.43 39.62,27.43 41.66,29.46 T1.DRAIN 43.79,28.34 43.79,23.54 45.51,21.82 53.73,21.82 54.65,22.73 54.65,23.15 U4.2 56.61,25.11 56.61,25.52 57.52,26.44 57.94,26.44 R_SHUNT.2
N$7
  Top 0.508: R5.1 STATUS.A
N$8
  Top 1.27: U3.1 U3.2 35.31,42.42 33.53,44.2 33.53,46.74 30.73,49.53 27.18,49.53 23.88,46.23 23.88,38.61 25.4,37.08 R1.2
N$9
  Top 0.508: R4.1 POWER.A
N$10
  Top 1.27: R_GAIN_100.1 GAIN_SELECT.4
N$11
  Top 1.27: T2.G 36.58,32 R3.1 40.64,32 T1.GATE
N$12
  Top 1.27: R_GAIN_25.2 R_GAIN_50.2 R_GAIN_100.2 R_GAIN_200.2
  Bottom 1.27: U4.1 60.71,24.13 R_GAIN_200.2
N$13
  Top 1.27: GAIN_SELECT.7 GAIN_SELECT.5 GAIN_SELECT.3 GAIN_SELECT.1 62.36,10.29 60.58,12.06 60.58,14.22 60.58,16 60.07,16.51 U4.8
N$14
  Top 1.27: R_GAIN_200.1 GAIN_SELECT.2
STATUS_LED
  Top 0.508: U1.1 7.37,64.26 11.18,68.07 11.18,71.63 14.73,75.18 44.2,75.18 R5.2

### Text on the board
tNames: SOCRAETES Recorder v0.3.12 / Universität Duisburg-Essen - NES / Hochschule Niederrhein - FB 03 | HRVST + - | INA121P | S/A | PC
bNames: Maximum solar cell current with R_shunt = 2R: / GAIN_ia = 25: I_max_record = 66 mA / GAIN_ia = 50: I_max_record = 33 mA / GAIN_ia = 100: I_max_record = 16.5 mA / GAIN_ia = 200: I_max_record = 8.25 mA